# EAGLE board GNUBLIN_EXTENDED_V1_7 (EAGLE 6.4), part 1 of 2
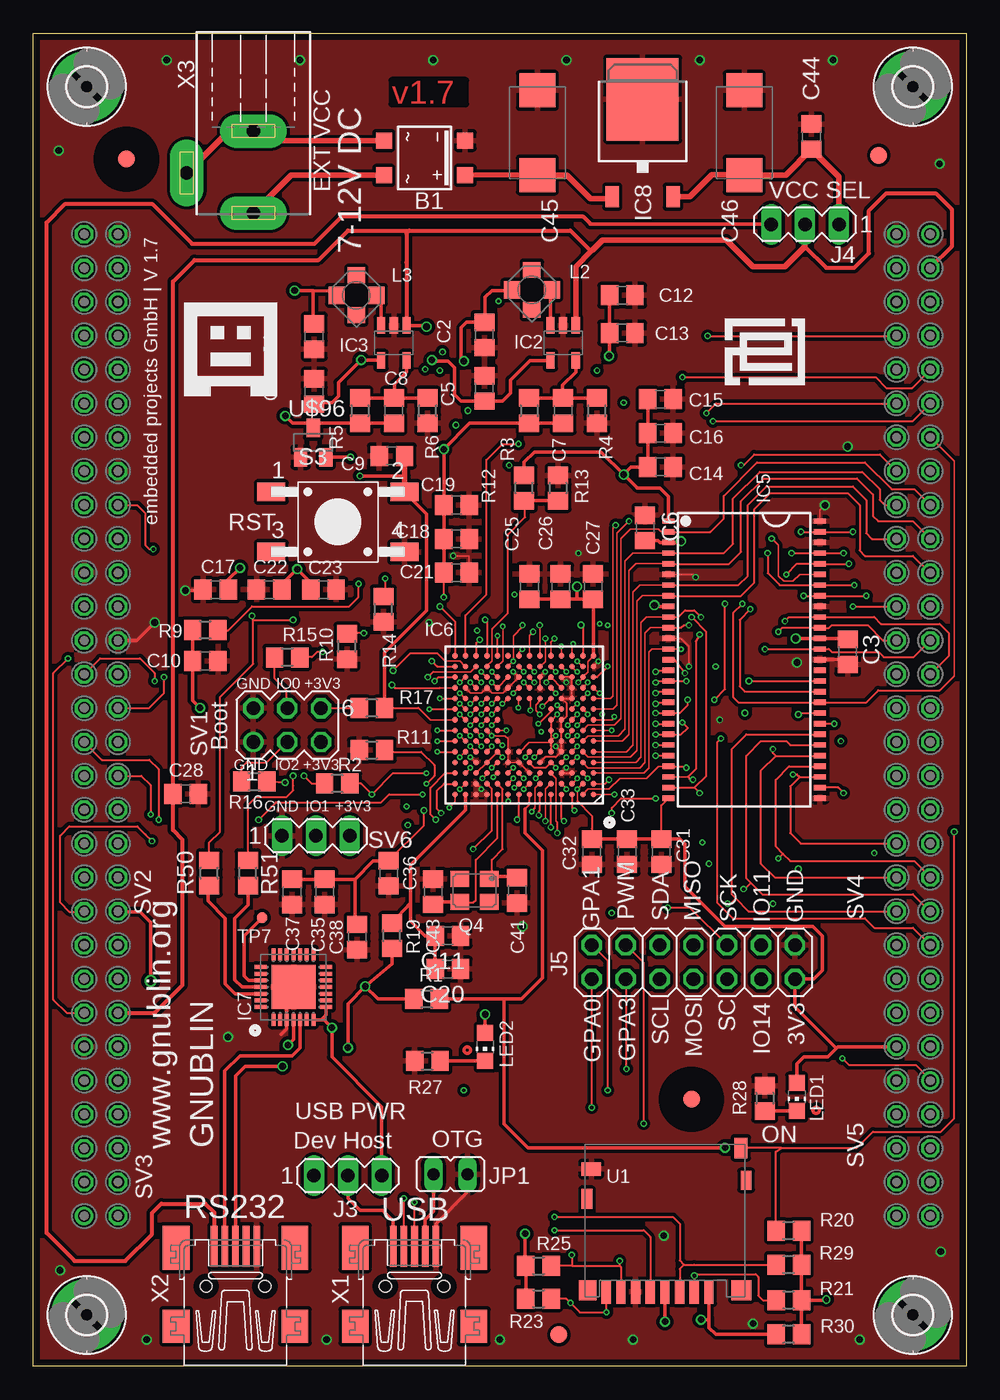
[diagram p3: board, top side]
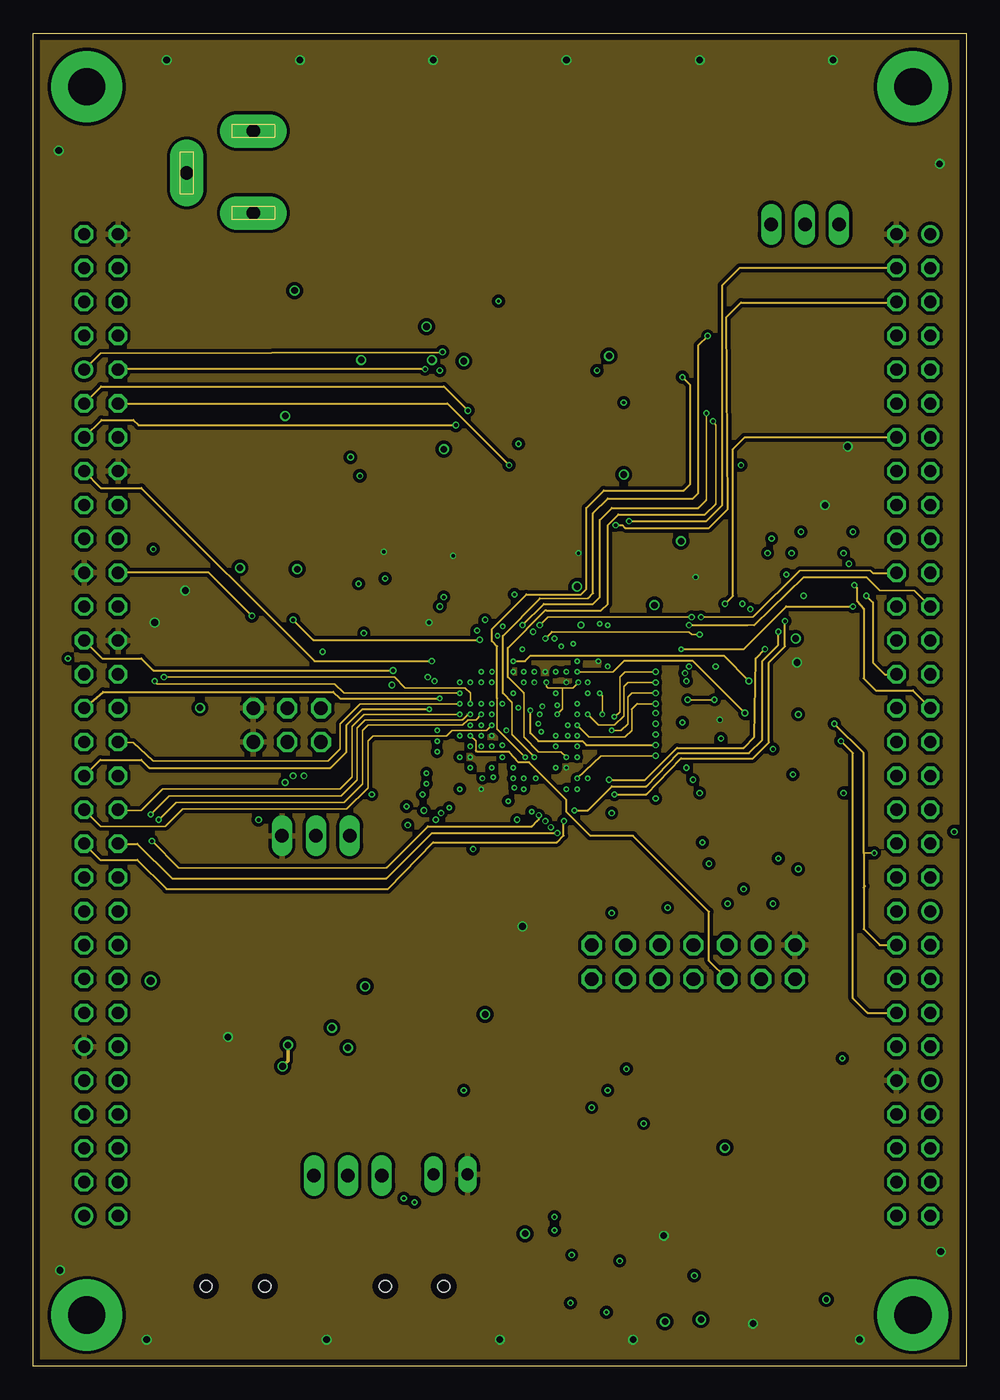
[diagram p4: board, inner layer Route2]
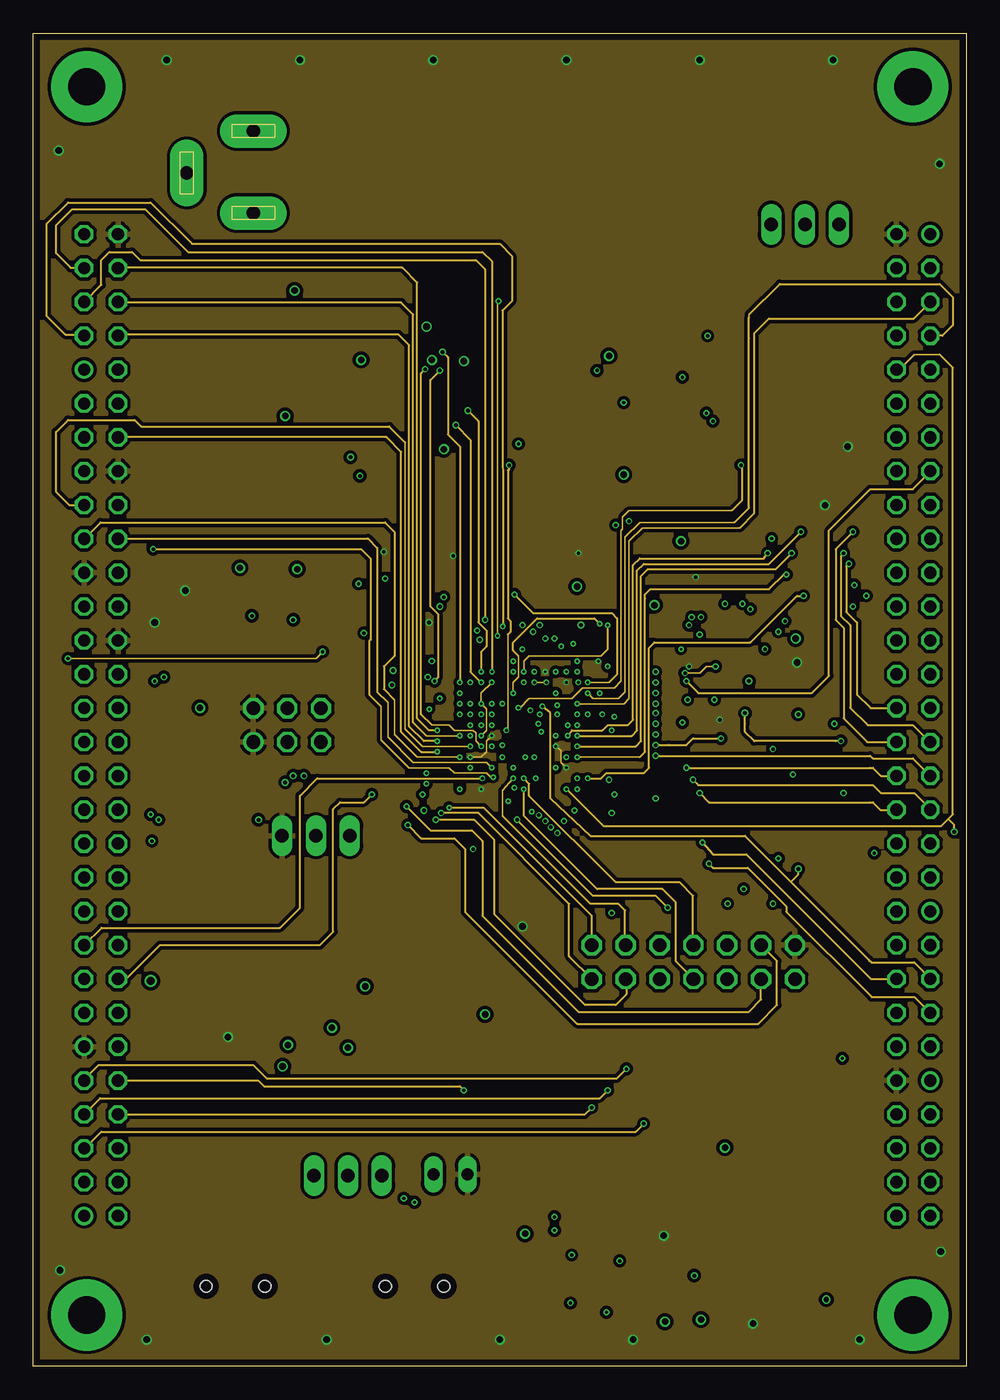
[diagram p5: board, inner layer Route3]
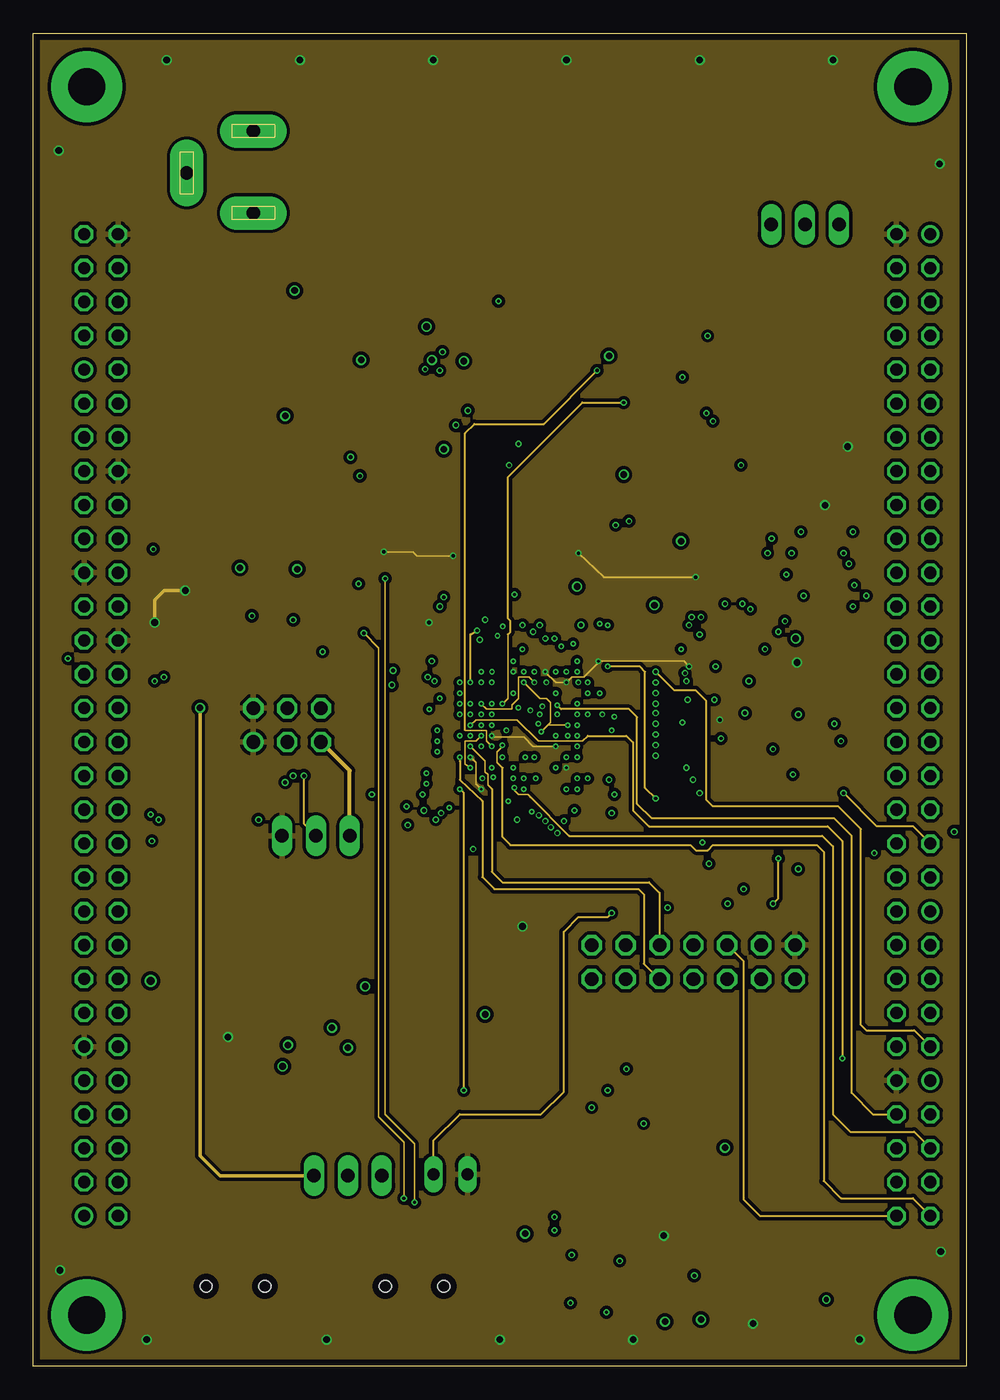
[diagram p6: board, inner layer Route4]
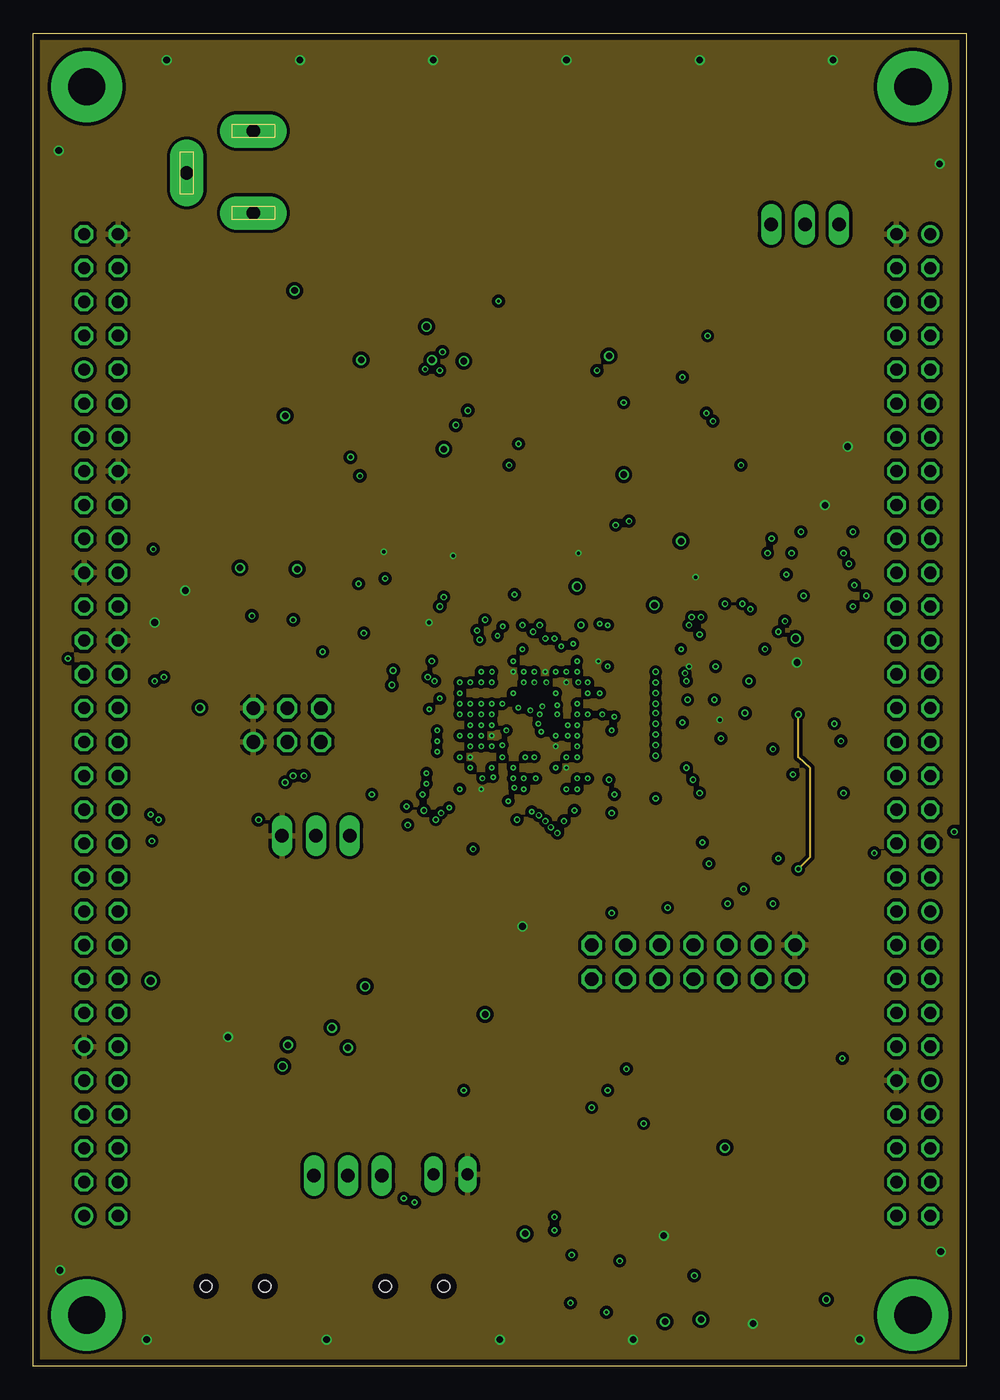
[diagram p7: board, inner layer Route5]
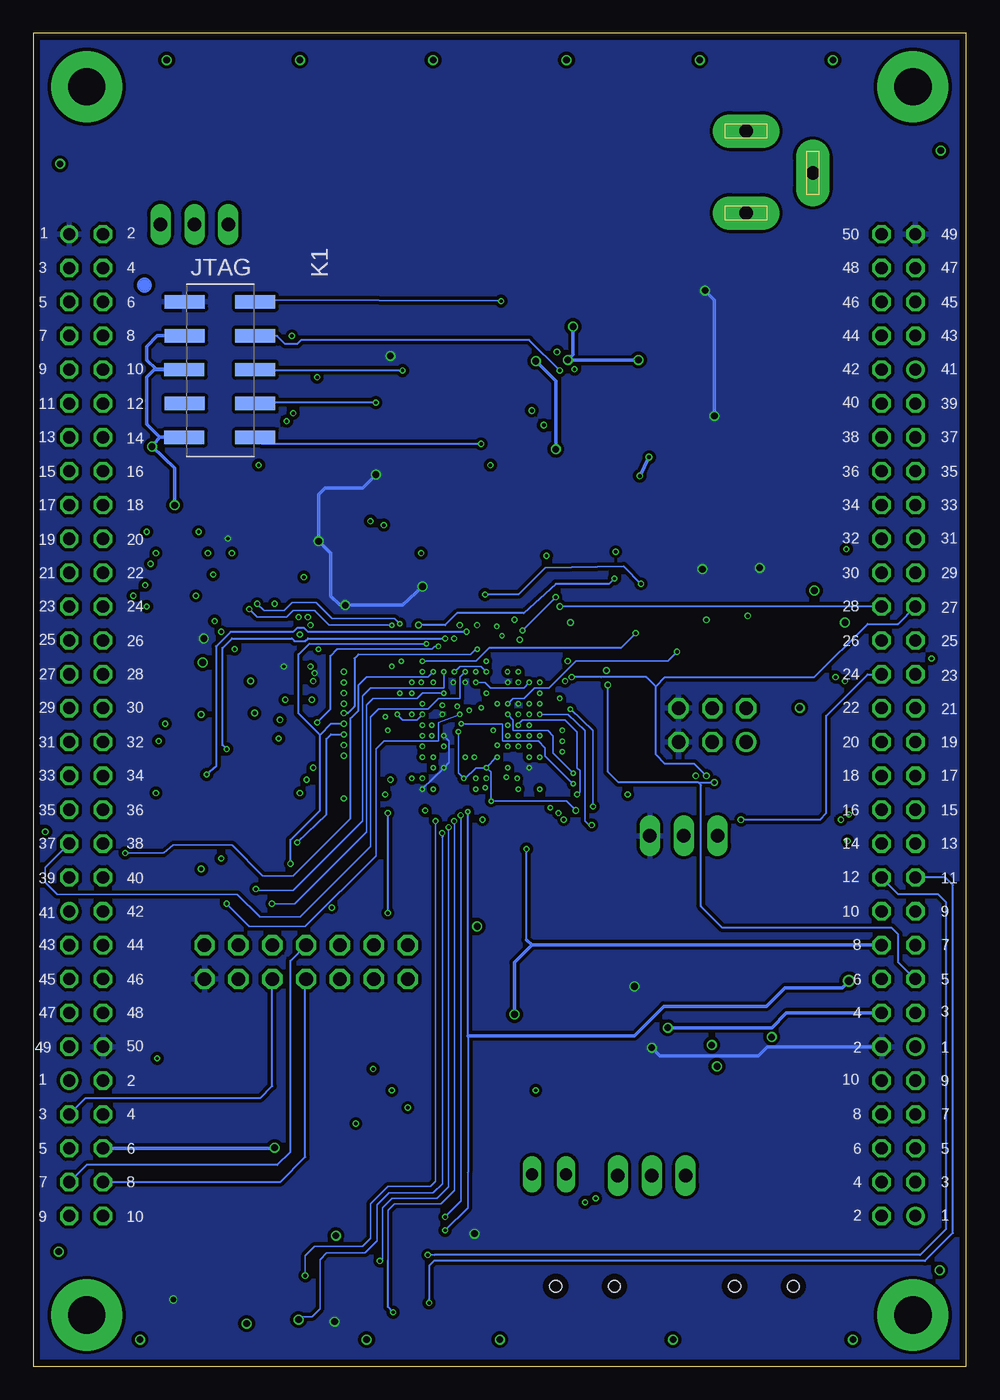
[diagram p8: board, bottom side, seen from below]

Size 70 x 100 mm. Coordinates in mm from the lower left corner, seen from the top.
Outline: 0,100 70,100 70,0 0,0 0,100
Copper layers (1*2+3*4+5*16): Top 0.035mm / dielectric 0.1mm / Route2 0.035mm / dielectric 0.1mm / Route3 0.035mm / dielectric 0.1mm / Route4 0.035mm / dielectric 0.2mm / Route5 0.035mm / dielectric 0.15mm / Bottom 0.035mm
Design rules "default *": minimum track width 0.125mm, minimum drill 0.2mm, track to track 0.125mm, track to pad 0.125mm, pad to pad 0.125mm, via to via 0.125mm, smd to smd 0mil, copper to edge 0.5mm, drill to drill 8mil, minimum pad ring 6mil, minimum via ring 4mil, stop-mask expansion 2mil, vias tented up to drill 20mil, thermal gap 10mil
Net classes: 0 default: width 0.254 mm, drill 0.7 mm, clearance 0.254 mm; 1 500mA: width 0.3 mm, drill 0.3 mm, clearance 0.15 mm

## Footprints (pad centres in the part's own frame; a part is rotated, then mirrored left to right if it is on the bottom)
SOIC-4 = smd 1.2 x 1.2: + 1.3,3.05; - -1.3,3.05; ~1 -1.3,-3.05; ~2 1.3,-3.05
C0805 = smd 1.3 x 1.5: 1 -0.95,0; 2 0.95,0
D/7343-31R = smd 2.55 x 2.7: + 3.175,0; - -3.175,0
PASSERMARKEN_FIDUCIAL = smd 1.27 x 1.27: 1 0,0
2,8-PAD = drill 2.8 pad 5.334: B2,8 0,0
TSOT23 = smd 0.622 x 1.22: 1 -0.95,-1.31; 2 0,-1.31; 3 0.95,-1.31; 4 0.95,1.31; 5 -0.95,1.31
TSOPII = smd 0.4 x 0.9: 1 1.03,0.67; 2 1.83,0.67; 3 2.63,0.67; 4 3.43,0.67; 5 4.23,0.67; 6 5.03,0.67; 7 5.83,0.67; 8 6.63,0.67; 9 7.43,0.67; 10 8.23,0.67; 11 9.03,0.67; 12 9.83,0.67; 13 10.63,0.67; 14 11.43,0.67; 15 12.23,0.67; 16 13.03,0.67; 17 13.83,0.67; 18 14.63,0.67; 19 15.43,0.67; 20 16.23,0.67; 21 17.03,0.67; 22 17.83,0.67; 23 18.63,0.67; 24 19.43,0.67; 25 20.23,0.67; 26 21.03,0.67; 27 21.83,0.67; 28 21.83,12.03; 29 21.03,12.03; 30 20.23,12.03; 31 19.43,12.03; 32 18.63,12.03; 33 17.83,12.03; 34 17.03,12.03; 35 16.23,12.03; 36 15.43,12.03; 37 14.63,12.03; 38 13.83,12.03; 39 13.03,12.03; 40 12.23,12.03; 41 11.43,12.03; 42 10.63,12.03; 43 9.83,12.03; 44 9.03,12.03; 45 8.23,12.03; 46 7.43,12.03; 47 6.63,12.03; 48 5.83,12.03; 49 5.03,12.03; 50 4.23,12.03; 51 3.43,12.03; 52 2.63,12.03; 53 1.83,12.03; 54 1.03,12.03
TFBGA180 = smd 0.4 x 0.4: A1 -5.2,5.2; A2 -4.4,5.2; A3 -3.6,5.2; A4 -2.8,5.2; A5 -2,5.2; A6 -1.2,5.2; A7 -0.4,5.2; A8 0.4,5.2; A9 1.2,5.2; A10 2,5.2; A11 2.8,5.2; A12 3.6,5.2; A13 4.4,5.2; A14 5.2,5.2; B1 -5.2,4.4; B2 -4.4,4.4; B3 -3.6,4.4; B4 -2.8,4.4; B5 -2,4.4; B6 -1.2,4.4; B7 -0.4,4.4; B8 0.4,4.4; B9 1.2,4.4; B10 2,4.4; B11 2.8,4.4; B12 3.6,4.4; B13 4.4,4.4; B14 5.2,4.4; C1 -5.2,3.6; C2 -4.4,3.6; C3 -3.6,3.6; C4 -2.8,3.6; C5 -2,3.6; C6 -1.2,3.6; C7 -0.4,3.6; C8 0.4,3.6; C9 1.2,3.6; C10 2,3.6; C11 2.8,3.6; C12 3.6,3.6; C13 4.4,3.6; C14 5.2,3.6; D1 -5.2,2.8; D2 -4.4,2.8; D3 -3.6,2.8; D4 -2.8,2.8; D5 -2,2.8; D6 -1.2,2.8; D7 -0.4,2.8; D8 0.4,2.8; D9 1.2,2.8; D10 2,2.8; D11 2.8,2.8; D12 3.6,2.8; D13 4.4,2.8; D14 5.2,2.8; E1 -5.2,2; E2 -4.4,2; E3 -3.6,2; E4 -2.8,2; E5 -2,2; E6 -1.2,2; E7 -0.4,2; E8 0.4,2; E9 1.2,2; E10 2,2; E11 2.8,2; E12 3.6,2; E13 4.4,2; E14 5.2,2; F1 -5.2,1.2; F2 -4.4,1.2; F3 -3.6,1.2; F4 -2.8,1.2; F5 -2,1.2; F10 2,1.2; F11 2.8,1.2; F12 3.6,1.2; F13 4.4,1.2; F14 5.2,1.2; G1 -5.2,0.4; G2 -4.4,0.4; G3 -3.6,0.4; G4 -2.8,0.4; G5 -2,0.4; G10 2,0.4; G11 2.8,0.4; G12 3.6,0.4; G13 4.4,0.4; G14 5.2,0.4; H1 -5.2,-0.4; H2 -4.4,-0.4; H3 -3.6,-0.4; H4 -2.8,-0.4; H5 -2,-0.4; H10 2,-0.4; H11 2.8,-0.4; H12 3.6,-0.4; H13 4.4,-0.4; H14 5.2,-0.4; J1 -5.2,-1.2; J2 -4.4,-1.2; J3 -3.6,-1.2; J4 -2.8,-1.2; J5 -2,-1.2; J10 2,-1.2; J11 2.8,-1.2; J12 3.6,-1.2; J13 4.4,-1.2; J14 5.2,-1.2; K1 -5.2,-2; K2 -4.4,-2; K3 -3.6,-2; K4 -2.8,-2; K5 -2,-2; K6 -1.2,-2; K7 -0.4,-2; K8 0.4,-2; K9 1.2,-2; K10 2,-2; K11 2.8,-2; K12 3.6,-2; K13 4.4,-2; K14 5.2,-2; L1 -5.2,-2.8; L2 -4.4,-2.8; L3 -3.6,-2.8; L4 -2.8,-2.8; L5 -2,-2.8; L6 -1.2,-2.8; L7 -0.4,-2.8; L8 0.4,-2.8; L9 1.2,-2.8; L10 2,-2.8; L11 2.8,-2.8; L12 3.6,-2.8; L13 4.4,-2.8; L14 5.2,-2.8; M1 -5.2,-3.6; M2 -4.4,-3.6; M3 -3.6,-3.6; M4 -2.8,-3.6; M5 -2,-3.6; M6 -1.2,-3.6; M7 -0.4,-3.6; M8 0.4,-3.6; M9 1.2,-3.6; M10 2,-3.6; M11 2.8,-3.6; M12 3.6,-3.6; M13 4.4,-3.6; M14 5.2,-3.6; N1 -5.2,-4.4; N2 -4.4,-4.4; N3 -3.6,-4.4; N4 -2.8,-4.4; N5 -2,-4.4; N6 -1.2,-4.4; N7 -0.4,-4.4; N8 0.4,-4.4; N9 1.2,-4.4; N10 2,-4.4; N11 2.8,-4.4; N12 3.6,-4.4; N13 4.4,-4.4; N14 5.2,-4.4; P1 -5.2,-5.2; P2 -4.4,-5.2; P3 -3.6,-5.2; P4 -2.8,-5.2; P5 -2,-5.2; P6 -1.2,-5.2; P7 -0.4,-5.2; P8 0.4,-5.2; P9 1.2,-5.2; P10 2,-5.2; P11 2.8,-5.2; P12 3.6,-5.2; P13 4.4,-5.2; P14 5.2,-5.2
MLP28 = smd 0.9 x 0.3: 1 -2.45,1.5; 2 -2.45,1; 3 -2.45,0.5; 4 -2.45,0; 5 -2.45,-0.5; 6 -2.45,-1; 7 -2.45,-1.5; 15 2.45,-1.5; 16 2.45,-1; 17 2.45,-0.5; 18 2.45,0; 19 2.45,0.5; 20 2.45,1; 21 2.45,1.5 | smd 0.3 x 0.9: 8 -1.5,-2.45; 9 -1,-2.45; 10 -0.5,-2.45; 11 0,-2.45; 12 0.5,-2.45; 13 1,-2.45; 14 1.5,-2.45; 22 1.5,2.45; 23 1,2.45; 24 0.5,2.45; 25 0,2.45; 26 -0.5,2.45; 27 -1,2.45; 28 -1.5,2.45 | smd 3.3 x 3.3: EXP 0,0
DPACK_3 = smd 1 x 1.6: 1 -2.28,-4.8; 3 2.28,-4.8 | smd 5.4 x 6.2: 4 0,2.5
MA03-1 = drill 1.016 long: 1 -2.54,0; 2 0,0; 3 2.54,0
2X07 = drill 1.016 octagon: 1 -7.62,-1.27; 2 -7.62,1.27; 3 -5.08,-1.27; 4 -5.08,1.27; 5 -2.54,-1.27; 6 -2.54,1.27; 7 0,-1.27; 8 0,1.27; 9 2.54,-1.27; 10 2.54,1.27; 11 5.08,-1.27; 12 5.08,1.27; 13 7.62,-1.27; 14 7.62,1.27
JP1 = drill 0.914 long: 1 0,-1.27; 2 0,1.27
61001021121 = smd 1 x 3: 1 -3.81,2.54; 2 -1.27,2.54; 3 1.27,2.54; 4 3.81,2.54; 5 6.35,2.54; 6 6.35,-2.79; 7 3.81,-2.76; 8 1.27,-2.79; 9 -1.27,-2.76; 10 -3.81,-2.76
PSU3014 = smd 1.2 x 1.3: 1 -1.5,0; 2 1.5,0 | smd 1.3 x 1.2: 3 0,1.5; 4 0,-1.5
CHIP-LED0805 = smd 1.2 x 1.2: A 0,-1.05; C 0,1.05
SX-32 = smd 1.4 x 1.2: 1 -1.1,-0.85; 2 1.1,-0.85; 3 1.1,0.85; 4 -1.1,0.85
R0805 = smd 1.3 x 1.5: 1 -0.95,0; 2 0.95,0
TASTER-9314_SMD = smd 2.1 x 1.4: 1 -5,2.25; 2 5,2.25; 3 -5,-2.25; 4 5,-2.25
MA03-2 = drill 1.016: 1 -2.54,-1.27 | drill 1.016 octagon: 2 -2.54,1.27; 3 0,-1.27; 4 0,1.27; 5 2.54,-1.27; 6 2.54,1.27
FE25-2 = drill 0.914: 1 -30.48,1.27; 41 20.32,1.27 | drill 0.914 octagon: 2 -30.48,-1.27; 3 -27.94,1.27; 4 -27.94,-1.27; 5 -25.4,1.27; 6 -25.4,-1.27; 7 -22.86,1.27; 8 -22.86,-1.27; 9 -20.32,1.27; 10 -20.32,-1.27; 11 -17.78,1.27; 12 -17.78,-1.27; 13 -15.24,1.27; 14 -15.24,-1.27; 15 -12.7,1.27; 16 -12.7,-1.27; 17 -10.16,1.27; 18 -10.16,-1.27; 19 -7.62,1.27; 20 -7.62,-1.27; 21 -5.08,1.27; 22 -5.08,-1.27; 23 -2.54,1.27; 24 -2.54,-1.27; 25 0,1.27; 26 0,-1.27; 27 2.54,1.27; 28 2.54,-1.27; 29 5.08,1.27; 30 5.08,-1.27; 31 7.62,1.27; 32 7.62,-1.27; 33 10.16,1.27; 34 10.16,-1.27; 35 12.7,1.27; 36 12.7,-1.27; 37 15.24,1.27; 38 15.24,-1.27; 39 17.78,1.27; 40 17.78,-1.27; 42 20.32,-1.27; 43 22.86,1.27; 44 22.86,-1.27; 45 25.4,1.27; 46 25.4,-1.27; 47 27.94,1.27; 48 27.94,-1.27; 49 30.48,1.27; 50 30.48,-1.27
FE05-2 = drill 0.914: 1 -5.08,1.27 | drill 0.914 octagon: 2 -5.08,-1.27; 3 -2.54,1.27; 4 -2.54,-1.27; 5 0,1.27; 6 0,-1.27; 7 2.54,1.27; 8 2.54,-1.27; 9 5.08,1.27; 10 5.08,-1.27
TP08R = smd 0.8 x 0.8: TP 0,0
DM3D-SF = smd 0.7 x 1.75: 1 7.7,-0.875; 2 6.6,-0.875; 3 5.5,-0.875; 4 4.4,-0.875; 5 3.3,-0.875; 6 2.2,-0.875; 7 1.1,-0.875; 8 0,-0.875 | smd 1.3 x 1.5: P$1 -1.4,-0.75 | smd 1.5 x 1.5: P$10 10.15,-0.75 | smd 0.8 x 1.4: P$11 10.5,7.5 | smd 0.8 x 1.5: P$13 -1.45,6.1 | smd 1 x 1.55: SW_A 10.1,9.925 | smd 1.45 x 1: SW_B -1.125,8.35
SOT23 = smd 1 x 1.4: 1 -0.95,-1.1; 2 0.95,-1.1; 3 0,1.1
32005-201 = smd 3.1 x 0.5: 1 3,1.6; 2 3,0.8; 3 3,0; 4 3,-0.8; 5 3,-1.6 | smd 2.5 x 2: M1 -3,-4.45; M2 -3,4.45 | smd 3.3 x 2: M3 2.9,4.45; M4 2.9,-4.45 | hole 0.9: 0,2.2; 0,-2.2
733980-62 = drill 1 pad 2.5 long: 1 0,8.57; 2 0,2.42; 3 5,5.57

## Placement (x,y rotation side)
B1  MB2S  [SOIC-4]  29.36,90.65 270 top
C1  10uF  [C0805]  21.07,77.24 90 top
C2  10uF  [C0805]  33.84,77.37 90 top
C3  100nF  [C0805]  61.1,53.6 90 top
C4  4.7uF  [C0805]  21.07,73.13 90 top
C5  4.7uF  [C0805]  33.84,73.36 90 top
C6  100nF  [C0805]  45.9,62.9 270 top
C7  22pF  [C0805]  39.75,71.69 90 top
C8  22pF  [C0805]  27.05,71.69 90 top
C9  100nF  [C0805]  26.9,68.3 180 top
C10  100nF  [C0805]  12.9,52.91 180 top
C11  100nF  [C0805]  31.1,32.3 180 top
C12  3.3nF  [C0805]  44.19,80.34 180 top
C13  10uF  [C0805]  44.19,77.51 180 top
C14  10uF  [C0805]  47.06,67.46 180 top
C15  3.3nF  [C0805]  47.06,72.54 180 top
C16  100nF  [C0805]  47.06,70 180 top
C17  3.3nF  [C0805]  13.68,58.26 0 top
C18  100nF  [C0805]  31.75,62.07 180 top
C19  3.3nF  [C0805]  31.75,64.61 180 top
C20  10uF  [C0805]  31.1,29.8 180 top
C21  10uF  [C0805]  31.75,59.53 180 top
C22  100nF  [C0805]  17.69,58.26 0 top
C23  10uF  [C0805]  21.77,58.26 180 top
C25  3.3nF  [C0805]  37.23,58.49 270 top
C26  100nF  [C0805]  39.57,58.49 270 top
C27  10uF  [C0805]  42.01,58.49 270 top
C28  2.2uF  [C0805]  11.43,42.95 0 top
C31  3.3nF  [C0805]  47.12,38.6 90 top
C32  10uF  [C0805]  41.9,38.6 90 top
C33  100nF  [C0805]  44.55,38.6 90 top
C35  100nF  [C0805]  21.86,35.58 90 top
C36  3.3nF  [C0805]  26.67,36.98 90 top
C37  10uF  [C0805]  19.42,35.58 90 top
C38  100nF  [C0805]  24.31,32.2 90 top
C41  22pF  [C0805]  36.3,35.7 90 top
C43  22pF  [C0805]  30,35.6 270 top
C44  100nF  [C0805]  58.38,92.25 90 top
C45  10uF  [D/7343-31R]  37.83,92.55 270 top
C46  10uF  [D/7343-31R]  53.34,92.55 270 top
FID1  [PASSERMARKEN_FIDUCIAL]  6.99,90.56 0 top
FID2  [PASSERMARKEN_FIDUCIAL]  49.39,20.02 0 top
FID3  [PASSERMARKEN_FIDUCIAL]  39.43,2.36 0 top
FID4  [PASSERMARKEN_FIDUCIAL]  63.43,90.85 0 top
H1  MOUNT-PAD-ROUND2.8  [2,8-PAD]  66,96 0 top
H2  MOUNT-PAD-ROUND2.8  [2,8-PAD]  4,3.84 0 top
H3  MOUNT-PAD-ROUND2.8  [2,8-PAD]  66,3.84 0 top
H4  MOUNT-PAD-ROUND2.8  [2,8-PAD]  4,96 0 top
IC2  AS1324  [TSOT23]  39.75,76.77 180 top
IC3  AS1324  [TSOT23]  27.05,76.77 180 top
IC5  A43E26161TSOPII  [TSOPII]  46.99,64.44 270 top
IC6  LPC313XFET180  [TFBGA180]  36.83,48.1 180 top
IC7  CP21021  [MLP28]  19.52,28.45 90 top
IC8  MC78M05ABDT  [DPACK_3]  45.72,92.55 0 top
J3  [MA03-1]  23.6,14.3 0 top
J4  [MA03-1]  57.91,85.67 180 top
J5  [2X07]  49.53,30.32 0 top
JP1  [JP1]  31.3,14.4 270 top
K1  61001021121  [61001021121]  55.88,76.04 270 bottom
L2  4u7  [PSU3014]  37.41,80.75 180 top
L3  4u7  [PSU3014]  24.24,80.35 180 top
LED1  GRUEN  [CHIP-LED0805]  57.29,20.2 180 top
LED2  ROT  [CHIP-LED0805]  33.9,23.95 180 top
Q4  SX-32 16MHz  [SX-32]  33.1,35.7 180 top
R1  10K  [R0805]  29.51,27.54 180 top
R2  10K  [R0805]  22.81,43.71 180 top
R3  301K  [R0805]  37.21,71.69 270 top
R4  301K  [R0805]  42.29,71.69 90 top
R5  301K  [R0805]  24.51,71.69 270 top
R6  66K5  [R0805]  29.59,71.69 90 top
R9  10K  [R0805]  12.9,55.25 0 top
R10  1M  [R0805]  23.53,54 90 top
R11  12K 1%  [R0805]  25.4,46.23 0 top
R12  10K  [R0805]  36.83,65.88 90 top
R13  DNP  [R0805]  39.37,65.88 270 top
R14  1M  [R0805]  26.27,56.79 90 top
R15  10K  [R0805]  19.05,53.18 180 top
R16  10K  [R0805]  16.58,43.86 0 top
R17  10K  [R0805]  25.4,49.37 180 top
R19  10K  [R0805]  26.9,32.29 90 top
R20  10K  [R0805]  56.69,10.17 180 top
R21  10K  [R0805]  56.69,4.96 180 top
R23  10K  [R0805]  37.91,5.06 0 top
R25  10K  [R0805]  37.91,7.53 0 top
R27  270R  [R0805]  29.57,22.9 0 top
R28  270R  [R0805]  54.88,20.1 270 top
R29  10K  [R0805]  56.69,7.62 180 top
R30  10K  [R0805]  56.69,2.38 180 top
R50  0R  [R0805]  13.2,37 90 top
R51  0R  [R0805]  16.1,37 90 top
S3  [TASTER-9314_SMD]  22.86,63.34 0 top
SV1  [MA03-2]  19.05,48.1 0 top
SV2  [FE25-2]  5.08,54.45 90 top
SV3  [FE05-2]  5.08,16.35 90 top
SV4  [FE25-2]  66.04,54.45 270 top
SV5  [FE05-2]  66.04,16.35 270 top
SV6  [MA03-1]  21.2,39.8 0 top
TP7  TPTP08R  [TP08R]  17.18,33.65 0 top
U1  DM3D-SF  [DM3D-SF]  42.99,6.45 0 top
U$1  EPLOGOSIEB  [EPLOGOSIEBDRUCK]  51.9,73.6 0 top
U$2  GNUBLINLOGOSIEB  [GNUSIEBDRUCK]  11.3,72.8 0 top
U$96  APX803  [SOT23]  21,69.3 0 top
X1  MINI-USB-32005-201  [32005-201]  28.6,6 90 top
X2  MINI-USB-32005-201  [32005-201]  15.17,5.99 90 top
X3  [733980-62]  16.51,95.09 180 top